# EAGLE design NOT-A (EAGLE 7.4.0)
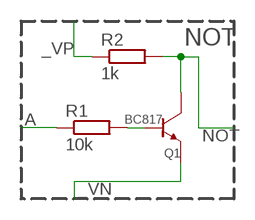
[diagram p0: schematic, sheet 1]

## Parts
Q1  BC817  TRANSISTOR-NPN-GENERICDEFAULT-SOT23-BEC  [SOT23]
R1  10k  R-EU_R0603  [R0603]
R2  1k  R-EU_R0603  [R0603]

## Nets
_VN: Q1.P$2(EMITTER)
_VP: R2.1
A: R1.1
N$14: Q1.P$1(BASE) R1.2
NOT: Q1.P$3(COLLECTOR) R2.2

## Notes on the sheet
- NOT

## Library data of the parts
Q1 = p.peter-gator:TRANSISTOR-NPN-GENERIC; SV_SPICE_MODEL: NPN (); SV_SPICE_ORDER: COLLECTOR;BASE;EMITTER; SV_SPICE_PREFIX: Q
R1 R2 = p.peter-gator:R-EU_: RESISTOR, European symbol; SV_SPICE_ORDER: 1;2; SV_SPICE_PREFIX: R

## Board
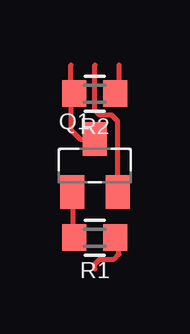
[diagram p1: board, top side]
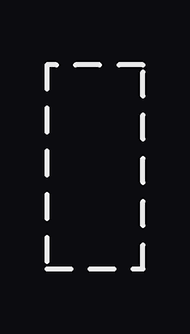
[diagram p2: board, bottom side, seen from below]

No outline drawn. Coordinates in mm, seen from the top.
Copper layers (1*16): Top 0.035mm / dielectric 1.5mm / Bottom 0.035mm
Design rules "Fusion_eagle_rule_v1.1 *": minimum track width 6mil, minimum drill 12mil, track to track 6mil, track to pad 6mil, pad to pad 6mil, via to via 6mil, smd to smd 0mil, copper to edge 10mil, drill to drill 10mil, minimum pad ring 15mil, minimum via ring 6mil, stop-mask expansion 2mil, vias tented up to drill 100mil, thermal gap 10mil

### Footprints (pad centres in the part's own frame; a part is rotated, then mirrored left to right if it is on the bottom)
SOT23 = smd 1 x 1.4: P$1 -0.95,-1.1; P$2 0.95,-1.1; P$3 0,1.1
R0603 = smd 1 x 1.1: 1 -0.85,0; 2 0.85,0

### Placement (x,y rotation side)
Q1  2,4.3 0 top
R1  2,1.3 180 top
R2  2,7.3 180 top

### Tracks (layer width: path | path; a pad name or v marks a point on that pad's centre or on a via)
_VN
  Top 0.2: Q1.P$2 2.95,6.15 2.7,6.4 2.2,6.4 2,6.6 2,8.5
_VP
  Top 0.2: 3,8.5 3,8.4 3,7.3 R2.1
A
  Top 0.2: 2,0 2,0.2 2.2,0.4 2.8,0.4 3,0.6 3,1.15 R1.1
N$14
  Top 0.2: R1.2 1.15,1.35 1.1,1.4 1.1,3.15 Q1.P$1
NOT
  Top 0.2: 1,7.3 1,8.5 | R2.2 1,7.3 | 1,7.3 1,5.8 1.4,5.4 Q1.P$3